# Altium schematic sheet SX1308_GTW_e381v02c_SX1308_part.SchDoc: SX1280_Demo_RF
size B; DrawnBy: Erik Fountain; DocumentNumber: 1; SheetNumber: 1; SheetTotal: 5; PageSetup: Record=PageOptions|CenterHorizontal=True|CenterVertical=True|PrintScale=0.72|XCorrection=1.00|YCorrection=1.00|PrintKind=0|BorderSize=5000000|LeftOffset=0|BottomOffset=0|Orientation=2|PaperLength=1000|PaperWidth=1000|Scale=100|PaperSource=7|PrintQuality=-4|MediaType=1|DitherType=10|PaperKind=Letter|PrintScaleMode=1; DocumentName: SX1280_Demo_RF
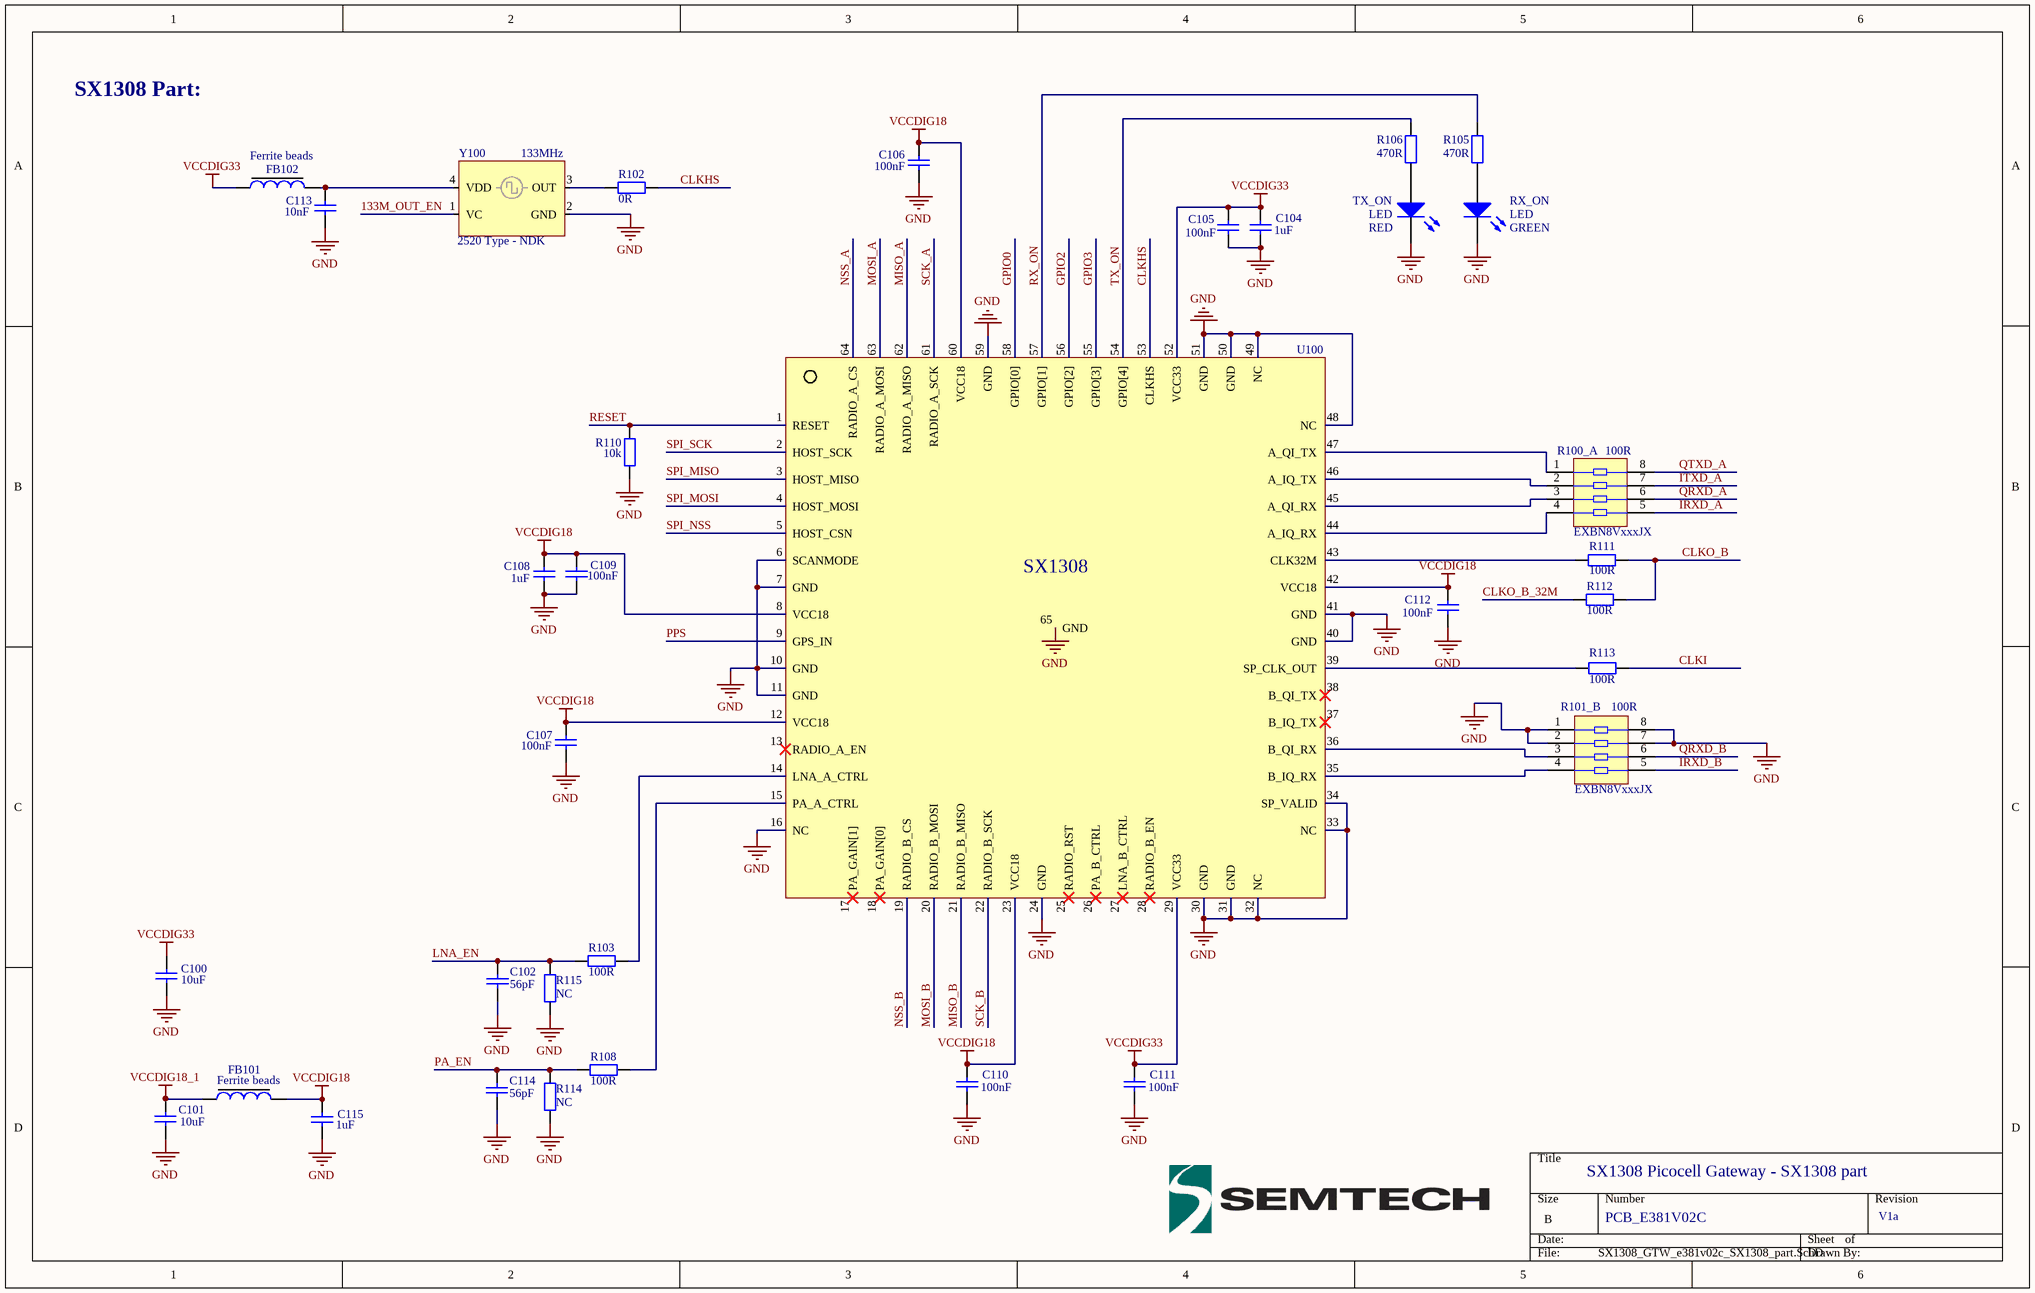
[diagram p0: SX1308_GTW_e381v02c_SX1308_part.SchDoc]

## Parts
C100  value 10uF  [rlc_805_smd]  (hidden comment: Cap)
C101  value 10uF  [rlc_805_smd]  (hidden comment: Cap)
C102  value 56pF  [rlc_402_smd]  (hidden comment: Cap)
C104  value 1uF  [rlc_603_smd]  (hidden comment: Cap)
C105  value 100nF  [rlc_402_smd]  (hidden comment: Cap)
C106  value 100nF  [rlc_402_smd]  (hidden comment: Cap)
C107  value 100nF  [rlc_402_smd]  (hidden comment: Cap)
C108  value 1uF  [rlc_603_smd]  (hidden comment: Cap)
C109  value 100nF  [rlc_402_smd]  (hidden comment: Cap)
C110  value 100nF  [rlc_402_smd]  (hidden comment: Cap)
C111  value 100nF  [rlc_402_smd]  (hidden comment: Cap)
C112  value 100nF  [rlc_402_smd]  (hidden comment: Cap)
C113  value 10nF  [rlc_402_smd]  (hidden comment: Cap)
C114  value 56pF  [rlc_402_smd]  (hidden comment: Cap)
C115  value 1uF  [rlc_603_smd]  (hidden comment: Cap)
FB101  Ferrite beads  [rlc_402_smd]
FB102  Ferrite beads  [rlc_402_smd]
R100_A  EXBN8VxxxJX  value 100R  [EXB28V]
R101_B  EXBN8VxxxJX  value 100R  [EXB28V]
R102  value 0R  [rlc_402_smd]  (hidden comment: Resistor)
R103  value 100R  [rlc_402_smd]  (hidden comment: Resistor)
R105  value 470R  [rlc_402_smd]  (hidden comment: Resistor)
R106  value 470R  [rlc_402_smd]  (hidden comment: Resistor)
R108  value 100R  [rlc_402_smd]  (hidden comment: Resistor)
R110  value 10k  [rlc_402_smd]  (hidden comment: Resistor)
R111  value 100R  [rlc_402_smd]  (hidden comment: Resistor)
R112  value 100R  [rlc_402_smd]  (hidden comment: Resistor)
R113  value 100R  [rlc_402_smd]  (hidden comment: Resistor)
R114  value NC  [rlc_402_smd]  (hidden comment: Resistor)
R115  value NC  [rlc_402_smd]  (hidden comment: Resistor)
RX_ON  LED  Type: GREEN  [CD3224]
TX_ON  LED  Type: RED  [CD3224]
U100  SX1308  [vqfn64_9x9mm]
Y100  2520 Type - NDK  value 133MHz  [TCXO 2.5x2.0mm]

## Nets
GND: C100.1 C101.1 C102.1 C104.1 C105.1 C106.1 C107.1 C108.1 C109.1 C110.1 C111.1 C112.1 C113.1 C114.1 C115.2 R101_B.1 R101_B.2 R101_B.7 R101_B.8 R110.1 R114.2 R115.2 RX_ON.2(K) TX_ON.2(K) U100.6(SCANMODE) U100.7(GND) U100.10(GND) U100.11(GND) U100.16(NC) U100.24(GND) U100.30(GND) U100.31(GND) U100.32(NC) U100.33(NC) U100.34(SP_VALID) U100.40(GND) U100.41(GND) U100.48(NC) U100.49(NC) U100.50(GND) U100.51(GND) U100.59(GND) U100.65(GND) Y100.2(GND)
VCCDIG18: C106.2 C107.2 C108.2 C109.2 C110.2 C112.2 C115.1 FB101.2 U100.8(VCC18) U100.12(VCC18) U100.23(VCC18) U100.42(VCC18) U100.60(VCC18)
VCCDIG18_1: C101.2 FB101.1
VCCDIG33: C100.2 C104.2 C105.2 C111.2 FB102.1 U100.29(VCC33) U100.52(VCC33)
133M_OUT_EN: Y100.1(VC)
CLKHS: R102.1 U100.53(CLKHS)
CLKI: R113.2
CLKO_B: R111.2 R112.2
CLKO_B_32M: R112.1
GPIO0: U100.58(GPIO[0])
GPIO2: U100.56(GPIO[2])
GPIO3: U100.55(GPIO[3])
IRXD_A: R100_A.5
IRXD_B: R101_B.5
ITXD_A: R100_A.7
LNA_EN: C102.2 R103.2 R115.1
MISO_A: U100.62(RADIO_A_MISO)
MISO_B: U100.21(RADIO_B_MISO)
MOSI_A: U100.63(RADIO_A_MOSI)
MOSI_B: U100.20(RADIO_B_MOSI)
NSS_A: U100.64(RADIO_A_CS)
NSS_B: U100.19(RADIO_B_CS)
PA_EN: C114.2 R108.2 R114.1
PPS: U100.9(GPS_IN)
QRXD_A: R100_A.6
QRXD_B: R101_B.6
QTXD_A: R100_A.8
RESET: R110.2 U100.1(RESET)
RX_ON: R105.2 U100.57(GPIO[1])
SCK_A: U100.61(RADIO_A_SCK)
SCK_B: U100.22(RADIO_B_SCK)
SPI_MISO: U100.3(HOST_MISO)
SPI_MOSI: U100.4(HOST_MOSI)
SPI_NSS: U100.5(HOST_CSN)
SPI_SCK: U100.2(HOST_SCK)
TX_ON: R106.2 U100.54(GPIO[4])
NetC113_2: C113.2 FB102.2 Y100.4(VDD)
NetR100_A_1: R100_A.1 U100.47(A_QI_TX)
NetR100_A_2: R100_A.2 U100.46(A_IQ_TX)
NetR100_A_3: R100_A.3 U100.45(A_QI_RX)
NetR100_A_4: R100_A.4 U100.44(A_IQ_RX)
NetR101_B_3: R101_B.3 U100.36(B_QI_RX)
NetR101_B_4: R101_B.4 U100.35(B_IQ_RX)
NetR102_2: R102.2 Y100.3(OUT)
NetR103_1: R103.1 U100.14(LNA_A_CTRL)
NetR105_1: R105.1 RX_ON.1(A)
NetR106_1: R106.1 TX_ON.1(A)
NetR108_1: R108.1 U100.15(PA_A_CTRL)
NetR111_1: R111.1 U100.43(CLK32M)
NetR113_1: R113.1 U100.39(SP_CLK_OUT)

Not connected (* = marked no-connect by the designer): U100 13(RADIO_A_EN)* 17(PA_GAIN[1])* 18(PA_GAIN[0])* 25(RADIO_RST)* 26(PA_B_CTRL)* 27(LNA_B_CTRL)* 28(RADIO_B_EN)* 37(B_IQ_TX)* 38(B_QI_TX)*

## Notes on the sheet
- SX1308 Part:
- SX1308 Picocell Gateway - SX1308 part
- PCB_E381V02C
- V1a

## Library data of the parts
C100-C102 C104-C115 = Cap: Capacitor SMD; Published: 8-Jun-2000; LatestRevisionDate: 05-oct-2007  -  Semtech; LatestRevisionNote: Re-released for DXP Platform.; Publisher: Altium Limited
FB101 FB102 = Ferrite beads: Value: VAL?
R100_A R101_B = EXBN8VxxxJX: Mini-Flat Package, Isolated Resistor Network, 0.031 W/resistor
R102 R103 R105 R106 R108 R110-R115 = Resistor: Resistor SMD - IEC symbol version; LatestRevisionDate: 27-Jul-20  -  Semtech
U100 = SX1301: SX1301 - Base Band Processor for Data Concentrator for Long Range Communication Network; Apps Pinout; LatestRevisionDate: 06-Dec-2013
Y100 = VCTCXO
RX_ON TX_ON = LED: LatestRevisionDate: 05-oct-2007  -  Semtech